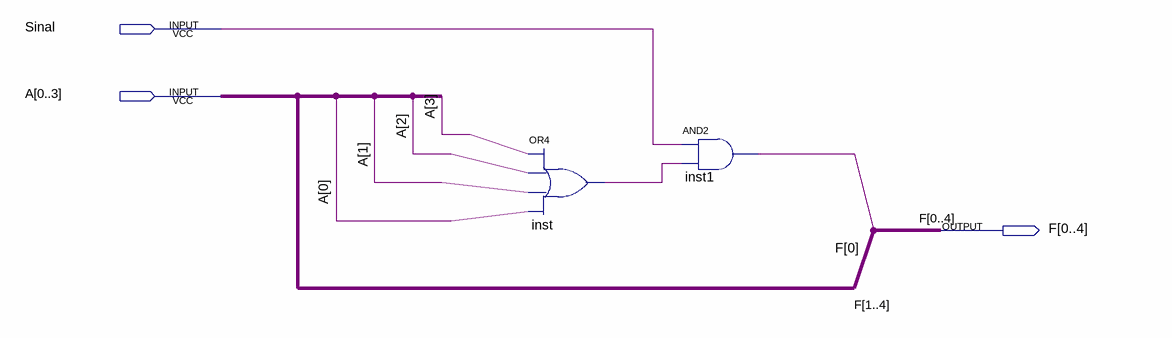
[diagram p0: schematic sheet]
// Quartus schematic CorretorZero.bdf as structural Verilog: 2 symbols, 3 pins
module CorretorZero (
  input  Sinal,
  input  [0:3] A,
  output [0:4] F
);

  wire inst_out;

  or inst (inst_out, A[3], A[2], A[1], A[0]);
  and inst1 (F[0], Sinal, inst_out);

  assign F[1:4] = A;
endmodule
